# EAGLE design dmx_noConn (EAGLE 6.4)
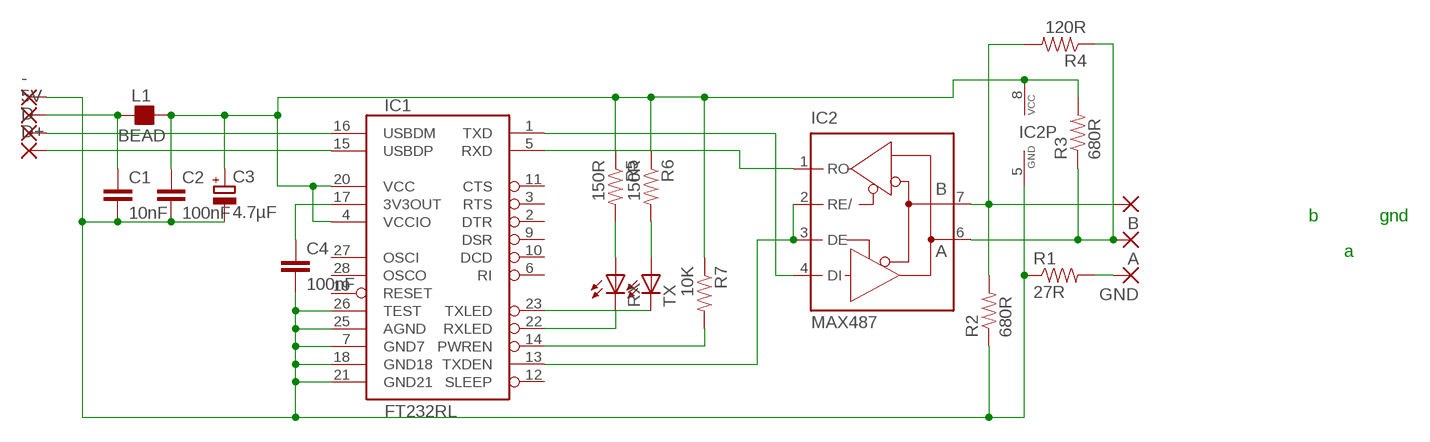
[diagram p0: schematic, sheet 1]

## Parts
5V  SMD5  [SMD2,54-5,08]
-  SMD5  [SMD2,54-5,08]
A  SMD5  [SMD2,54-5,08]
B  SMD5  [SMD2,54-5,08]
C1  10nF  CAP0805  [0805]
C2  100nF  CAP0805  [0805]
C3  4.7µF  CPOL-EUSMCC  [SMC_C]
C4  100nF  CAP0805  [0805]
D+  SMD5  [SMD2,54-5,08]
D-  SMD5  [SMD2,54-5,08]
GND  SMD5  [SMD2,54-5,08]
IC1  FT232RL  FT232RLSSOP  [SSOP28DB]
IC2  MAX487  MAX481CSA  [SO08]
L1  BEAD  FB_0805  [L0805]
R1  27R  RESISTOR0805-RES  [0805]
R2  680R  RESISTOR0805-RES  [0805]
R3  680R  RESISTOR0805-RES  [0805]
R4  120R  RESISTOR0805-RES  [0805]
R5  150R  RESISTOR0805-RES  [0805]
R6  150R  RESISTOR0805-RES  [0805]
R7  10K  RESISTOR0805-RES  [0805]
RX  LEDCHIP-LED0805  [CHIP-LED0805]
TX  LEDCHIP-LED0805  [CHIP-LED0805]

## Nets
+USB_SIEVED: C2.1 C3.+ IC1.4(VCCIO) IC1.20(VCC) IC2.8(VCC) L1.2 R3.2 R5.1 R6.1 R7.1
GND_USB: -.1(P) C1.2 C2.2 C3.- C4.2 IC1.7(GND7) IC1.18(GND18) IC1.21(GND21) IC1.25(AGND) IC1.26(TEST) IC2.5(GND) R1.1 R2.1
N$1: IC1.13(TXDEN) IC2.2(RE/) IC2.3(DE)
N$2: GND.1(P) R1.2
N$3: IC1.5(RXD) IC2.1(RO)
N$4: IC1.1(TXD) IC2.4(DI)
N$5: B.1(P) IC2.7(B) R2.2 R4.2
N$6: A.1(P) IC2.6(A) R3.1 R4.1
N$7: D-.1(P) IC1.16(USBDM)
N$24: D+.1(P) IC1.15(USBDP)
N$25: R5.2 RX.A
N$26: R6.2 TX.A
N$27: IC1.22(RXLED) RX.C
N$28: IC1.23(TXLED) TX.C
N$29: C4.1 IC1.17(3V3OUT)
N$30: 5V.1(P) C1.1 L1.1
N$31: IC1.14(PWREN) R7.2
Unconnected: IC1.2(DTR) IC1.3(RTS) IC1.6(RI) IC1.9(DSR) IC1.10(DCD) IC1.11(CTS) IC1.12(SLEEP) IC1.19(RESET) IC1.27(OSCI) IC1.28(OSCO)

## Notes on the sheet
- b | gnd
- a

## Library data of the parts
5V - A B D+ D- GND = wirepad:SMD5: SMD PAD
C1 C2 C4 = SparkFun:CAP: Capacitor Standard 0603 ceramic capacitor, and 0.1" leaded capacitor.
C3 = resistor:CPOL-EU: POLARIZED CAPACITOR, European symbol
IC1 = SparkFun:FT232RL: USB UART FT232RL 4th Generation USB UART (USB <-> Serial) Controller. Spark Fun Electronics SKU : COM-00650
IC2 = maxim:MAX481CSA: RS485 TRANSEIVER; MF: MAXIM; MPN: MAX481CSA; OC_FARNELL: unknown; OC_NEWARK: 90C3817
L1 = rc-master-smd:FB_: FERRITE BEAD
R1-R7 = SparkFun:RESISTOR: Resistor Basic schematic elements and footprints for 0603, 1206, and PTH resistors.
RX TX = led:LED: LED OSRAM: - CHIPLED LG R971, LG N971, LY N971, LG Q971, LY Q971, LO R971, LY R971 LH N974, LH R974 LS Q976, LO Q976, LY Q976 LO Q996 - Hyper CHIPLED LW Q18S LB Q993, LB Q99A, LB R99A - SideLED LS A670, LO A670, LY A670, LG A670, LP A670 LB A673, LV A673, LT A673, LW A673 LH A674 LY A675 LS A676, LA A676, LO A676, LY A676, LW A676 LS A679, LY A679, LG A679 - Hyper Micro SIDELED® LS Y876, LA Y876, LO Y876, LY Y876 LT Y87S - SmartLED LW L88C, LW L88S LB L89C, LB L89S, LG L890 LS L89K, LO L89K, LY L89K LS L896, LA L896, LO L896, LY L896 - TOPLED LS T670, LO T670, LY T670, LG T670, LP T670 LSG T670, LSP T670, LSY T670, LOP T670, LYG T670 LG T671, LOG T671, LSG T671 LB T673, LV T673, LT T673, LW T673 LH T674 LS T676, LA T676, LO T676, LY T676, LB T676, LH T676, LSB T676, LW T676 LB T67C, LV T67C, LT T67C, LS T67K, LO T67K, LY T67K, LW E67C LS E67B, LA E67B, LO E67B, LY E67B, LB E67C, LV E67C, LT E67C LW T67C LS T679, LY T679, LG T679 LS T770, LO T770, LY T770, LG T770, LP T770 LB T773, LV T773, LT T773, LW T773 LH T774 LS E675, LA E675, LY E675, LS T675 LS T776, LA T776, LO T776, LY T776, LB T776 LHGB T686 LT T68C, LB T68C - Hyper Mini TOPLED® LB M676 - Mini TOPLED Santana® LG M470 LS M47K, LO M47K, LY M47K Source: http://www.osram.convergy.de LUXEON: - LUMILED® LXK2-PW12-R00, LXK2-PW12-S00, LXK2-PW14-U00, LXK2-PW14-V00 LXK2-PM12-R00, LXK2-PM12-S00, LXK2-PM14-U00 LXK2-PE12-Q00, LXK2-PE12-R00, LXK2-PE12-S00, LXK2-PE14-T00, LXK2-PE14-U00 LXK2-PB12-K00, LXK2-PB12-L00, LXK2-PB12-M00, LXK2-PB14-N00, LXK2-PB14-P00, LXK2-PB14-Q00 LXK2-PR12-L00, LXK2-PR12-M00, LXK2-PR14-Q00, LXK2-PR14-R00 LXK2-PD12-Q00, LXK2-PD12-R00, LXK2-PD12-S00 LXK2-PH12-R00, LXK2-PH12-S00 LXK2-PL12-P00, LXK2-PL12-Q00, LXK2-PL12-R00 Source: www.luxeon.com KINGBRIGHT: KA-3528ASYC Source: www.kingbright.com

## Board
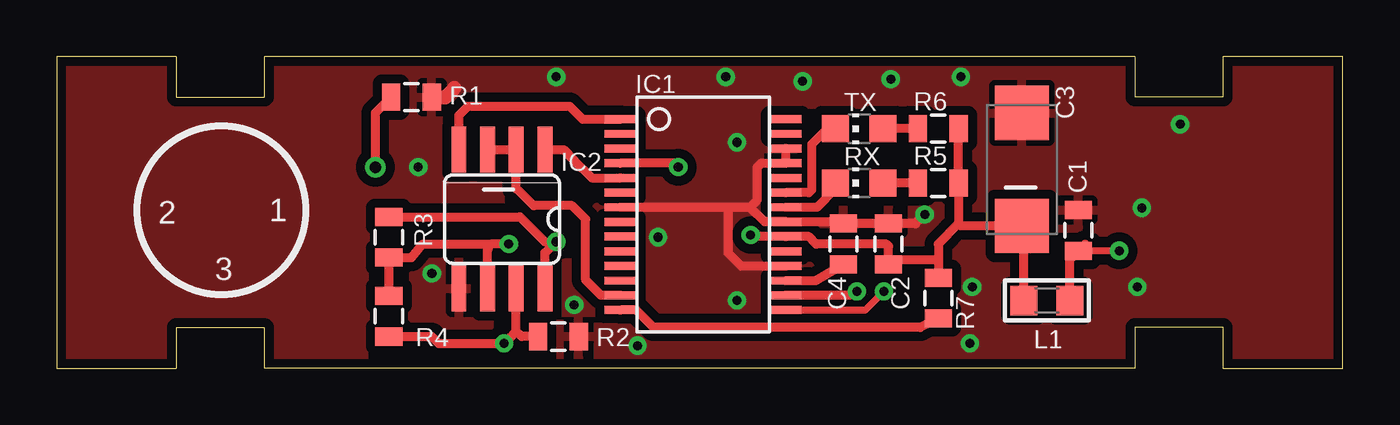
[diagram p1: board, top side]
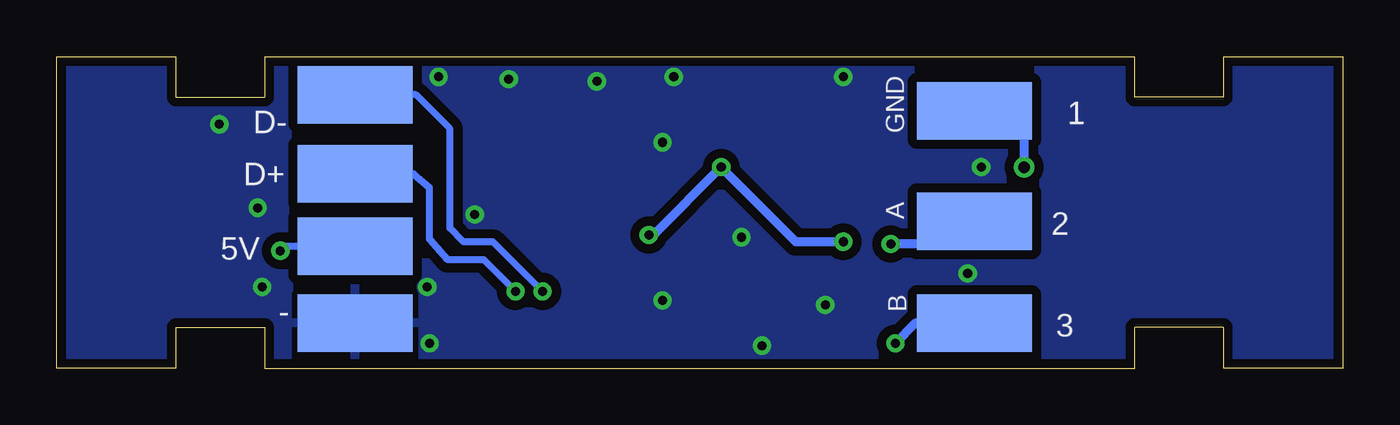
[diagram p2: board, bottom side, seen from below]

Size 56.9 x 13.8 mm. Coordinates in mm from the lower left corner, seen from the top.
Outline: 0,0 5.3,0 5.3,1.8 9.2,1.8 9.2,0 47.7,0 47.7,1.8 51.6,1.8 51.6,0 56.9,0 56.9,13.8 51.6,13.8 51.6,12 47.7,12 47.7,13.8 9.2,13.8 9.2,12 5.3,12 5.3,13.8 0,13.8 0,0
Copper layers (1*16): Top 0.035mm / dielectric 1.5mm / Bottom 0.035mm
Design rules "default": minimum track width 0.2mm, minimum drill 0.4mm, track to track 0.2mm, track to pad 0.2mm, pad to pad 0.2mm, via to via 0.2mm, smd to smd 0mil, copper to edge 0.4mm, drill to drill 8mil, minimum pad ring 0.3mm, minimum via ring 8mil, stop-mask expansion 4mil, vias tented up to drill 40mil, thermal gap 10mil

### Footprints (pad centres in the part's own frame; a part is rotated, then mirrored left to right if it is on the bottom)
SMD2,54-5,08 = smd 2.54 x 5.08: 1 0,0
0805 = smd 0.8 x 1.2: 1 -0.9,0; 2 0.9,0
SMC_C = smd 2.4 x 2.4: + -2.5,0; - 2.5,0
SSOP28DB = smd 0.348 x 1.397: 1 -4.225,-3.656; 2 -3.575,-3.656; 3 -2.925,-3.656; 4 -2.275,-3.656; 5 -1.625,-3.656; 6 -0.975,-3.656; 7 -0.325,-3.656; 8 0.325,-3.656; 9 0.975,-3.656; 10 1.625,-3.656; 11 2.275,-3.656; 12 2.925,-3.656; 13 3.575,-3.656; 14 4.225,-3.656; 15 4.225,3.656; 16 3.575,3.656; 17 2.925,3.656; 18 2.275,3.656; 19 1.625,3.656; 20 0.975,3.656; 21 0.325,3.656; 22 -0.325,3.656; 23 -0.975,3.656; 24 -1.625,3.656; 25 -2.275,3.656; 26 -2.925,3.656; 27 -3.575,3.656; 28 -4.225,3.656
SO08 = smd 0.66 x 2.032: 1 -1.905,-3.073; 2 -0.635,-3.073; 3 0.635,-3.073; 4 1.905,-3.073; 5 1.905,3.073; 6 0.635,3.073; 7 -0.635,3.073; 8 -1.905,3.073
L0805 = smd 1.2 x 1.3: 1 -1.016,0; 2 1.016,0
CHIP-LED0805 = smd 1.2 x 1.2: A 0,-1.05; C 0,1.05

### Placement (x,y rotation side)
5V  43.7,5.4 90 bottom
-  43.7,2 90 bottom
A  16.3,6.5 90 bottom
B  16.3,2 90 bottom
C1  45.2,6.1 90 top
C2  36.8,5.5 90 top
C3  42.7,8.8 90 top
C4  34.8,5.5 90 top
D+  43.7,8.6 90 bottom
D-  43.7,12.1 90 bottom
GND  16.3,11.4 90 bottom
IC1  28.6,6.8 270 top
IC2  19.7,6.6 180 top
L1  43.8,3 180 top
R1  15.7,12 180 top
R2  22.2,1.4 180 top
R3  14.7,5.8 90 top
R4  14.7,2.3 270 top
R5  39,8.2 180 top
R6  39,10.6 180 top
R7  39,3.1 270 top
RX  35.5,8.2 90 top
TX  35.5,10.6 90 top

### Tracks (layer width: path | path; a pad name or v marks a point on that pad's centre or on a via)
+USB_SIEVED  (via drill 0.4)
  Top 0.406: v30.7,5.9 30.77,5.83 IC1.20 33.27,5.83 33.6,5.5 36.7,5.5 36.8,5.4 C2.1 37,4.8 39,4.8 | v27.5,8.9 27.32,9.08 IC1.4 | 39.1,4.1 R7.1 39,4.8 | R6.1 R5.1 39.9,6.4 | 39,4.8 39,5.5 39.9,6.4 | IC2.8 21.61,5.11 v22.1,5.6 21.6,5.6 20.5,6.7 R3.2 | L1.2 42.78,6.22 C3.+ 40,6.3 39.9,6.4
  Bottom 0.406: v30.7,5.9 30.5,5.9 v27.5,8.9 24.2,5.6 v22.1,5.6
GND_USB  (via drill 0.4)
  Top 0.406: IC1.21 32.23,6.5 31.4,6.5 | 30.68,7.12 29.7,7.12 | 29.7,7.12 IC1.7 | 30.68,7.12 31.32,6.47 IC1.21 | IC1.18 30.27,4.52 29.7,5.1 29.7,7.12 | IC1.21 34.73,6.47 C4.2 C2.2 38,6.4 v38.4,6.8 | IC1.26 IC1.25 31.18,9.08 31,8.9 31,7.45 30.68,7.12
  Top 0.61: R1.1 17.2,12 17.6,12.4
  other vias: 40.5,3.6 40.4,1.1 40,12.9 30.1,10 26.6,5.8 30.1,3 22.1,12.9 22.9,2.8 16.6,4.2 36.9,12.8 29.6,12.9 47.8,3.6 33,12.7 49.7,10.8 16,8.9 25.7,1 48,7.1
  pour Bottom (isolate 0.406): 0,0 56.9,0.1 56.8,13.9 0,13.8
  pour Top (isolate 0.406): 0,0 56.9,0.1 56.8,13.9 0,13.8
N$1
  Top 0.406: IC2.3 IC2.2 20.34,7.97 20.5,7.8 21.1,7.2 22.8,7.2 23.4,6.6 23.4,3.9 24.07,3.22 IC1.13
N$2  (via drill 0.5)
  Top 0.406: R1.2 14.1,11.3 v14.1,8.9
  Bottom 0.406: v14.1,8.9 14.1,10.2 14.8,10.9 15.8,10.9 GND.1
N$3
  Top 0.406: IC2.1 22.43,9.67 22.9,9.2 23.68,8.42 IC1.5
N$4
  Top 0.406: IC2.4 17.8,11.19 18.2,11.6 22.7,11.6 23,11.3 23.27,11.02 IC1.1
N$5  (via drill 0.4)
  Top 0.406: v19.8,1.1 16.9,1.1 16.6,1.4 R4.2 | v19.8,1.1 20.05,1.35 | 20.05,1.35 20.3,1.6 20.34,1.63 | 20.34,1.63 IC2.7 | R2.2 20.57,1.4 20.34,1.63 | v19.8,1.1 20.05,1.35
  Bottom 0.406: B.1 18.9,2 v19.8,1.1
N$6  (via drill 0.4)
  Top 0.406: IC2.6 19.07,5.23 19.12,5.38 | v20,5.5 19.23,5.5 19.12,5.38 | R4.1 R3.1 15.7,4.9 16.2,5.5 19.2,5.5 19.12,5.38
  Bottom 0.406: A.1 17.3,5.5 v20,5.5
N$7  (via drill 0.4)
  Top 0.406: IC1.16 35.08,3.22 v35.4,3.4
  Bottom 0.305: v35.4,3.4 37.6,5.6 38.9,5.6 39.5,6.2 39.5,10.6 41,12.1 D-.1
N$24  (via drill 0.4)
  Top 0.305: IC1.15 35.77,2.58 v36.6,3.4
  Bottom 0.305: D+.1 41.1,8.6 40.4,8 40.4,5.7 39.6,4.8 38,4.8 v36.6,3.4
N$25
  Top 0.406: R5.2 RX.A
N$26
  Top 0.406: R6.2 TX.A
N$27
  Top 0.406: IC1.22 33.62,7.12 34.45,7.95 RX.C
N$28
  Top 0.406: IC1.23 33.27,7.77 33.4,7.9 33.4,9.9 34.1,10.6 TX.C
N$29
  Top 0.406: IC1.17 33.58,3.88 C4.1
N$30  (via drill 0.4)
  Top 0.305: v47,5.2 C1.1
  Top 0.406: 45.5,5.5 C1.1 44.82,4.82 L1.1
  Bottom 0.305: 5V.1 46.8,5.4 v47,5.2
N$31
  Top 0.406: R7.2 38.2,1.8 26.4,1.8 25.62,2.58 IC1.14

### Text on the board
tPlace: 2 | 1 | 3
bPlace: 1 | 2 | 3